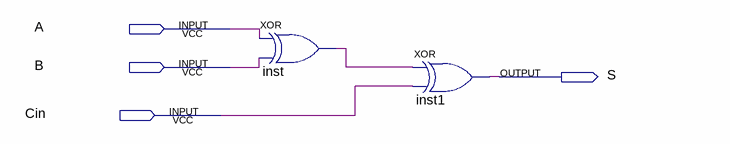
[diagram p0: schematic sheet]
// Quartus schematic fulladder.bdf as structural Verilog: 2 symbols, 4 pins
module fulladder (
  input  A,
  input  B,
  input  Cin,
  output S
);

  wire inst_out;

  xor inst (inst_out, A, B);
  xor inst1 (S, inst_out, Cin);
endmodule
